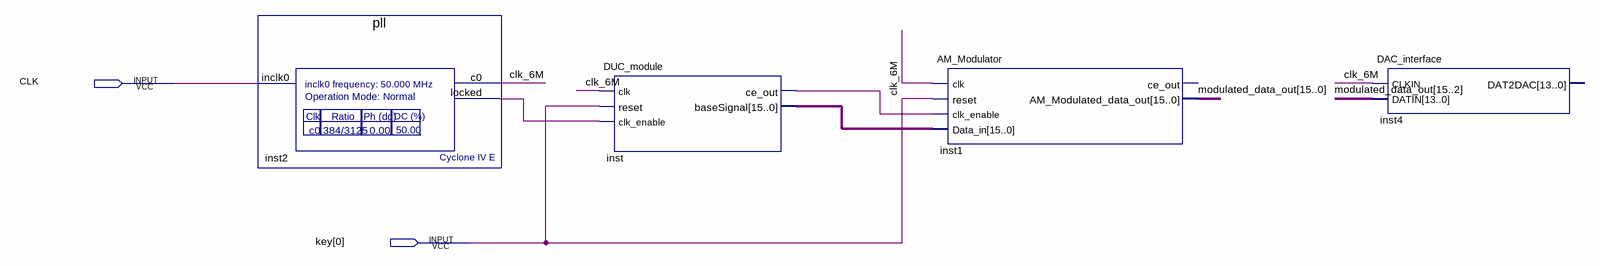
[diagram p0: schematic sheet]
// Quartus schematic DUCTEST.bdf as structural Verilog: 4 symbols, 2 pins
module DUCTEST (
  input  CLK,
  input  [0:0] key
);

  wire clk_6M, inst2_locked, inst_ce_out;
  wire [15:0] inst_basesignal, modulated_data_out;

  pll inst2 (.inclk0(CLK), .c0(clk_6M), .locked(inst2_locked));
  DUC_module inst (
    .clk(clk_6M), .reset(key[0]), .clk_enable(inst2_locked), .ce_out(inst_ce_out),
    .baseSignal(inst_basesignal));
  AM_Modulator inst1 (
    .clk(clk_6M), .reset(key[0]), .clk_enable(inst_ce_out), .Data_in(inst_basesignal),
    .AM_Modulated_data_out(modulated_data_out));  // open: ce_out
  DAC_interface inst4 (.CLKIN(clk_6M), .DATIN(modulated_data_out[15:2]));  // open: DAT2DAC
endmodule
